# Altium project Dev_Kit_esp32.PrjPcb
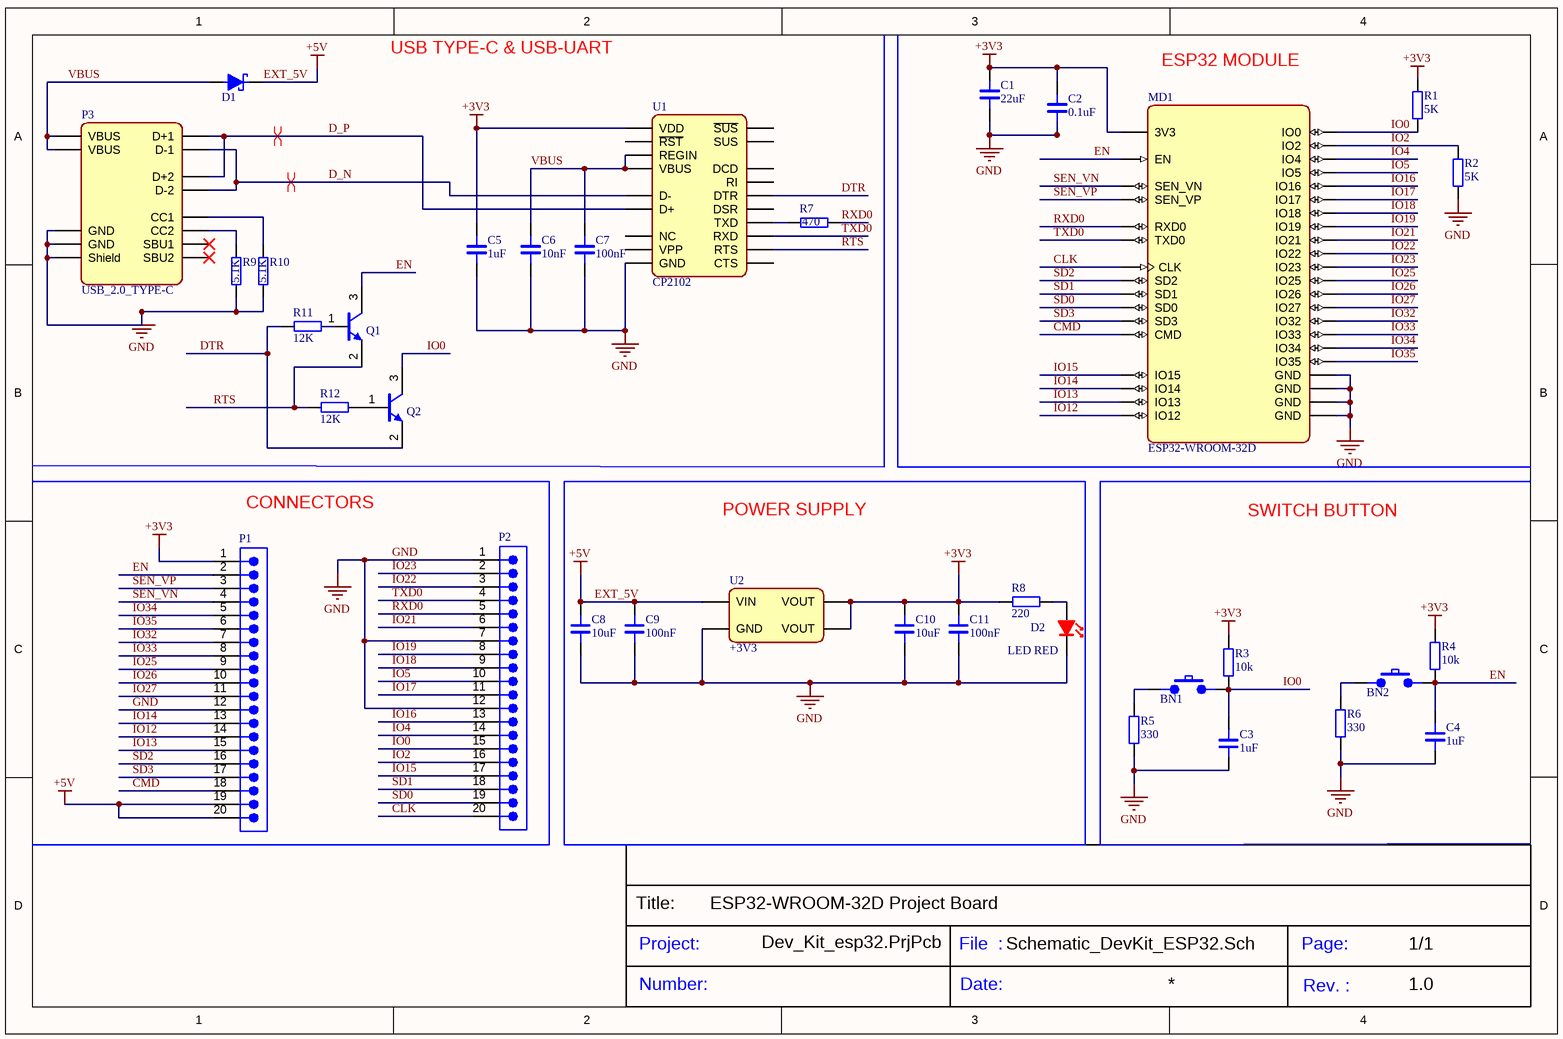
[diagram p0: Schematic_DevKit_ESP32.SchDoc]
1 sheet, 35 parts. Net scope: global (net labels, ports and power ports of the same name join across sheets).
Board file: PCB_DevKit_ESP32.PcbDoc

## Sheet Schematic_DevKit_ESP32.SchDoc
size A4; SheetNumber: 1; SheetTotal: 1

### Parts
BN1  SKRPABE010  [BTN_SKRPABE010]  (value not drawn)
BN2  SKRPABE010  [BTN_SKRPABE010]  (value not drawn)
C1  22uF  [CAP_0603]
C2  0.1uF  [CAP_0603]
C3  1uF  [CAP_0603]
C4  1uF  [CAP_0603]
C5  1uF  [CAP_0603]
C6  10nF  [CAP_0603]
C7  100nF  [CAP_0603]
C8  10uF  [CAP_0603]
C9  100nF  [CAP_0603]
C10  10uF  [CAP_0603]
C11  100nF  [CAP_0603]
D1  SS34  [DIO_SMA]  (value not drawn)
D2  LED RED  [LED_RED_V0805]
MD1  ESP32-WROOM-32D  [MD_ESP32_WROOM_D]
P1  61302011121  [61302011121]  (value not drawn)
P2  61302011121  [61302011121]  (value not drawn)
P3  USB_2.0_TYPE-C  [CON_USB_2.0_TYPE-C]
Q1  BC846x  [BJT_ BC846x]  (value not drawn)
Q2  BC846x  [BJT_ BC846x]  (value not drawn)
R1  5K  [RES_0603]
R2  5K  [RES_0603]
R3  10k  [RES_0603]
R4  10k  [RES_0603]
R5  330  [RES_0603]
R6  330  [RES_0603]
R7  470  [RES_0603]
R8  220  [RES_0603]
R9  5.1K  [RES_0603]
R10  5.1K  [RES_0603]
R11  12K  [RES_0603]
R12  12K  [RES_0603]
U1  CP2102  [INF_CP2102]
U2  +3V3  [PWR_LD1117_SOT223]

### Nets
+3V3: C1.2 C2.2 C5.2 C10.2 C11.2 MD1.2(3V3) P1.1 R1.2 R3.2 R4.2 R8.1 U1.6(VDD) U2.2(VOUT) U2.4(VOUT)
EXT_5V: C8.2 C9.2 D1.C P1.19 P1.20 U2.3(VIN)  [also labelled +5V]
GND: C1.1 C2.1 C3.1 C4.1 C5.1 C6.1 C7.1 C8.1 C9.1 C10.1 C11.1 D2.C MD1.1(GND) MD1.15(GND) MD1.38(GND) MD1.39(GND) P1.12 P2.1 P2.7 P2.12 P3.A1/B12(GND) P3.A12/B1(GND) P3.Shell(Shield) R2.1 R5.1 R6.1 R9.1 R10.1 U1.3(GND) U2.1(GND)
CLK: MD1.20(CLK) P2.20
CMD: MD1.19(CMD) P1.18
D_N: P3.A7(D-1) P3.B7(D-2) U1.5(D-)
D_P: P3.A6(D+1) P3.B6(D+2) U1.4(D+)
DTR: Q2.2(E) R11.1 U1.28(DTR)
EN: BN2.34 C4.2 MD1.3(EN) P1.2 Q1.3(C) R4.1
IO0: BN1.34 C3.2 MD1.25(IO0) P2.15 Q2.3(C) R1.1 R3.1
IO2: MD1.24(IO2) P2.16 R2.2
IO4: MD1.26(IO4) P2.14
IO5: MD1.29(IO5) P2.10
IO12: MD1.14(IO12) P1.14
IO13: MD1.16(IO13) P1.15
IO14: MD1.13(IO14) P1.13
IO15: MD1.23(IO15) P2.17
IO16: MD1.27(IO16) P2.13
IO17: MD1.28(IO17) P2.11
IO18: MD1.30(IO18) P2.9
IO19: MD1.31(IO19) P2.8
IO21: MD1.33(IO21) P2.6
IO22: MD1.36(IO22) P2.3
IO23: MD1.37(IO23) P2.2
IO25: MD1.10(IO25) P1.9
IO26: MD1.11(IO26) P1.10
IO27: MD1.12(IO27) P1.11
IO32: MD1.8(IO32) P1.7
IO33: MD1.9(IO33) P1.8
IO34: MD1.6(IO34) P1.5
IO35: MD1.7(IO35) P1.6
RTS: Q1.2(E) R12.1 U1.24(RTS)
RXD0: MD1.34(RXD0) P2.5 R7.2
SD0: MD1.21(SD0) P2.19
SD1: MD1.22(SD1) P2.18
SD2: MD1.17(SD2) P1.16
SD3: MD1.18(SD3) P1.17
SEN_VN: MD1.5(SEN_VN) P1.4
SEN_VP: MD1.4(SEN_VP) P1.3
TXD0: MD1.35(TXD0) P2.4 U1.25(RXD)
VBUS: C6.2 C7.2 D1.A P3.A4/B9(VBUS) P3.A9/B4(VBUS) U1.7(REGIN) U1.8(VBUS)
NetBN1_12: BN1.12 R5.2
NetBN2_12: BN2.12 R6.2
NetD2_A: D2.A R8.2
NetP3_A5: P3.A5(CC1) R10.2
NetP3_B5: P3.B5(CC2) R9.2
NetQ1_1: Q1.1(B) R11.2
NetQ2_1: Q2.1(B) R12.2
NetR7_1: R7.1 U1.26(TXD)

Not connected (* = marked no-connect by the designer): P3 A8(SBU1)* B8(SBU2)*; U1 1(DCD) 2(RI) 9(~{RST}) 10,13,14,15,16,17,19,20,21,22(NC) 11(~{SUS}) 12(SUS) 18(VPP) 23(CTS) 27(DSR)

### Layout directives
differential pair: D_N, D_P

### Notes on the sheet
- USB TYPE-C & USB-UART
- ESP32 MODULE
- (near P1) CONNECTORS
- POWER SUPPLY
- SWITCH BUTTON
- Title:       ESP32-WROOM-32D Project Board
- Project:
- Number:
- File  :
- Date:
- Schematic_DevKit_ESP32.Sch
- Page:
- Rev. :
- 1/1
- 1.0

### Library data of the parts
BN1 BN2 = BTN_SKRPABE010: 3.2mm 2.5mm button 50mA Brick SPST 16V SMD Tactile Switches; Mfr. Part: SKRPABE010; JLCPCB Part: ?; LCSC Part: ?
C1 = CAP_0603: 0603 Multilayer Ceramic Capacitors MLCC - SMD/SMT ROHS; Mfr. Part: CL10A226MP8NUNE; Voltage: 10V; LCSC Part: C86295; JLCPCB Part: ?; Value: 22uF
C2 = CAP_0603: 0603 Multilayer Ceramic Capacitors MLCC - SMD/SMT ROHS; Mfr. Part: CGA0603X7R104K100JT; Voltage: 10V; LCSC Part: C36911391; JLCPCB Part: ?; Value: 0.1uF
C3-C5 = CAP_0603: 0603 Multilayer Ceramic Capacitors MLCC - SMD/SMT ROHS; Mfr. Part: 0603X105K100NT; Voltage: 10V; LCSC Part: C111590; JLCPCB Part: ?; Value: 1uF
C6 = CAP_0603: 0603 Multilayer Ceramic Capacitors MLCC - SMD/SMT ROHS; Mfr. Part: CGA0603X7R103K100JT; Voltage: 10V; LCSC Part: C36911415; JLCPCB Part: ?; Value: 10nF
C7 = CAP_0603: 0603 Multilayer Ceramic Capacitors MLCC - SMD/SMT ROHS; Mfr. Part: CC0603KRX7R6BB104; Voltage: 10V; LCSC Part: C519438; JLCPCB Part: ?; Value: 100nF
C8 C10 = CAP_0603: 0603 Multilayer Ceramic Capacitors MLCC - SMD/SMT ROHS; Mfr. Part: CL10A106KP8NNNC; Voltage: 10V; LCSC Part: C19702; JLCPCB Part: ?; Value: 10uF
C9 C11 = CAP_0603: 0603 Multilayer Ceramic Capacitors MLCC - SMD/SMT ROHS; LCSC Part: ?; JLCPCB Part: ?; Mfr. Part: ?; Value: 100nF; Voltage: ?
D1 = DIO_SS34: 40V 500mV@3A 3A SMC (SBD); Mfr. Part: SS34; JLCPCB Part: ?; LCSC Part: C8678
D2 = LED_RED_V0805: 20mA 615nm~630nm RED; JLCPCB Part: ?; LCSC Part: ?; Mrf. Part: ?
MD1 = MD_ESP32_WROOM_D: core ESP32-D0WD, 32Mbits, 3.3V, 40Mhz, onboard antenna; Mfr. Part: ESP32-WROOM-32D-N4; LCSC Part: C473012; JLCPCB Part: ?
P1 P2 = CMP-1502-01102-3: NexarPartId: 32855554; Operating Supply Voltage: 250V; Gender: Male; Current Rating: 3A; Contact Resistance: 20mΩ; Number of Contacts: 20; Pitch: 2.54mm; Connector Type: Male Pin; RoHS: Compliant; Contact Plating: Gold; REACH SVHC: Unknown; Packaging: Bulk; Lead Pitch: 2.54mm; Mount: Through Hole; Termination: Solder; Number of Pins: 20; Contact Mating Length: 5.9944mm; Number of Rows: 1; Color: Black; Contact Material: Copper; Orientation: Vertical; Number of Positions: 20
P3 = CON_USB_2.0_TYPE-C: USB Connectors USB Jack 2.0, Type-C, Horizontal SMT; Mfr. Part: GT-USB-7010ASV; LCSC Part: C2988369; JLCPCB Part: ?
Q1 Q2 = BJT_ BC846x: Single Bipolar Transistor, NPN, 65 V, 100 mA, 250 mW, SOT23 (TO-236AB), 3 Pins, Surface Mount; Mfr. Part: BC846B; LCSC Part: C5338312; JLCPCB Part: ?
R1 R2 = RES_0603: 0603 Thick Film Resistor - Surface Mount ROHS; Mfr. Part: RTT035001FTP; LCSC Part: C166926; JLCPCB Part: ?; Value: 5K
R3 R4 = RES_0603: 0603 Thick Film Resistor - Surface Mount ROHS; Mfr. Part: FRC0603J103 TS; LCSC Part: C2930027; JLCPCB Part: ?; Value: 10k
R5 = RES_0603: 0603 Thick Film Resistor - Surface Mount ROHS; Mfr. Part: 0603WAJ0331T5E; LCSC Part: C25231; JLCPCB Part: ?; Value: 330
R6 = RES_0603: 0603 Thick Film Resistor - Surface Mount ROHS; Mfr. Part: ?; LCSC Part: ?; JLCPCB Part: ?; Value: 330
R7 = RES_0603: 0603 Thick Film Resistor - Surface Mount ROHS; Mfr. Part: FRC0603F4700TS; LCSC Part: C2907041; JLCPCB Part: ?; Value: 470
R8 = RES_0603: 0603 Thick Film Resistor - Surface Mount ROHS; Mfr. Part: FRC0603F2200TS; LCSC Part: C2907014; JLCPCB Part: ?; Value: 220
R9 R10 = RES_0603: 0603 Thick Film Resistor - Surface Mount ROHS; Mfr. Part: FRC0603F5101TS; LCSC Part: C2907044; JLCPCB Part: ?; Value: 5.1K
R11 R12 = RES_0603: 0603 Thick Film Resistor - Surface Mount ROHS; Mfr. Part: FRC0603F1202TS; LCSC Part: C2906989; JLCPCB Part: ?; Value: 12K
U1 = INF_CP2102: USB to UART bridge USB 2.0 3.3V, CP2102-GMR, VFQFN-28; Mfr. Part: CP2102-GMR; LCSC Part: C6568; JLCPCB Part: ?
U2 = PWR_LD1117: Linear Voltage Regulators (LDO); Mfr. Part: LD1117-3.3; LCSC Part: C347229; JLCPCB Part: ?; Value: +3V3